# EAGLE design Connector_Board (EAGLE 9.6.1)
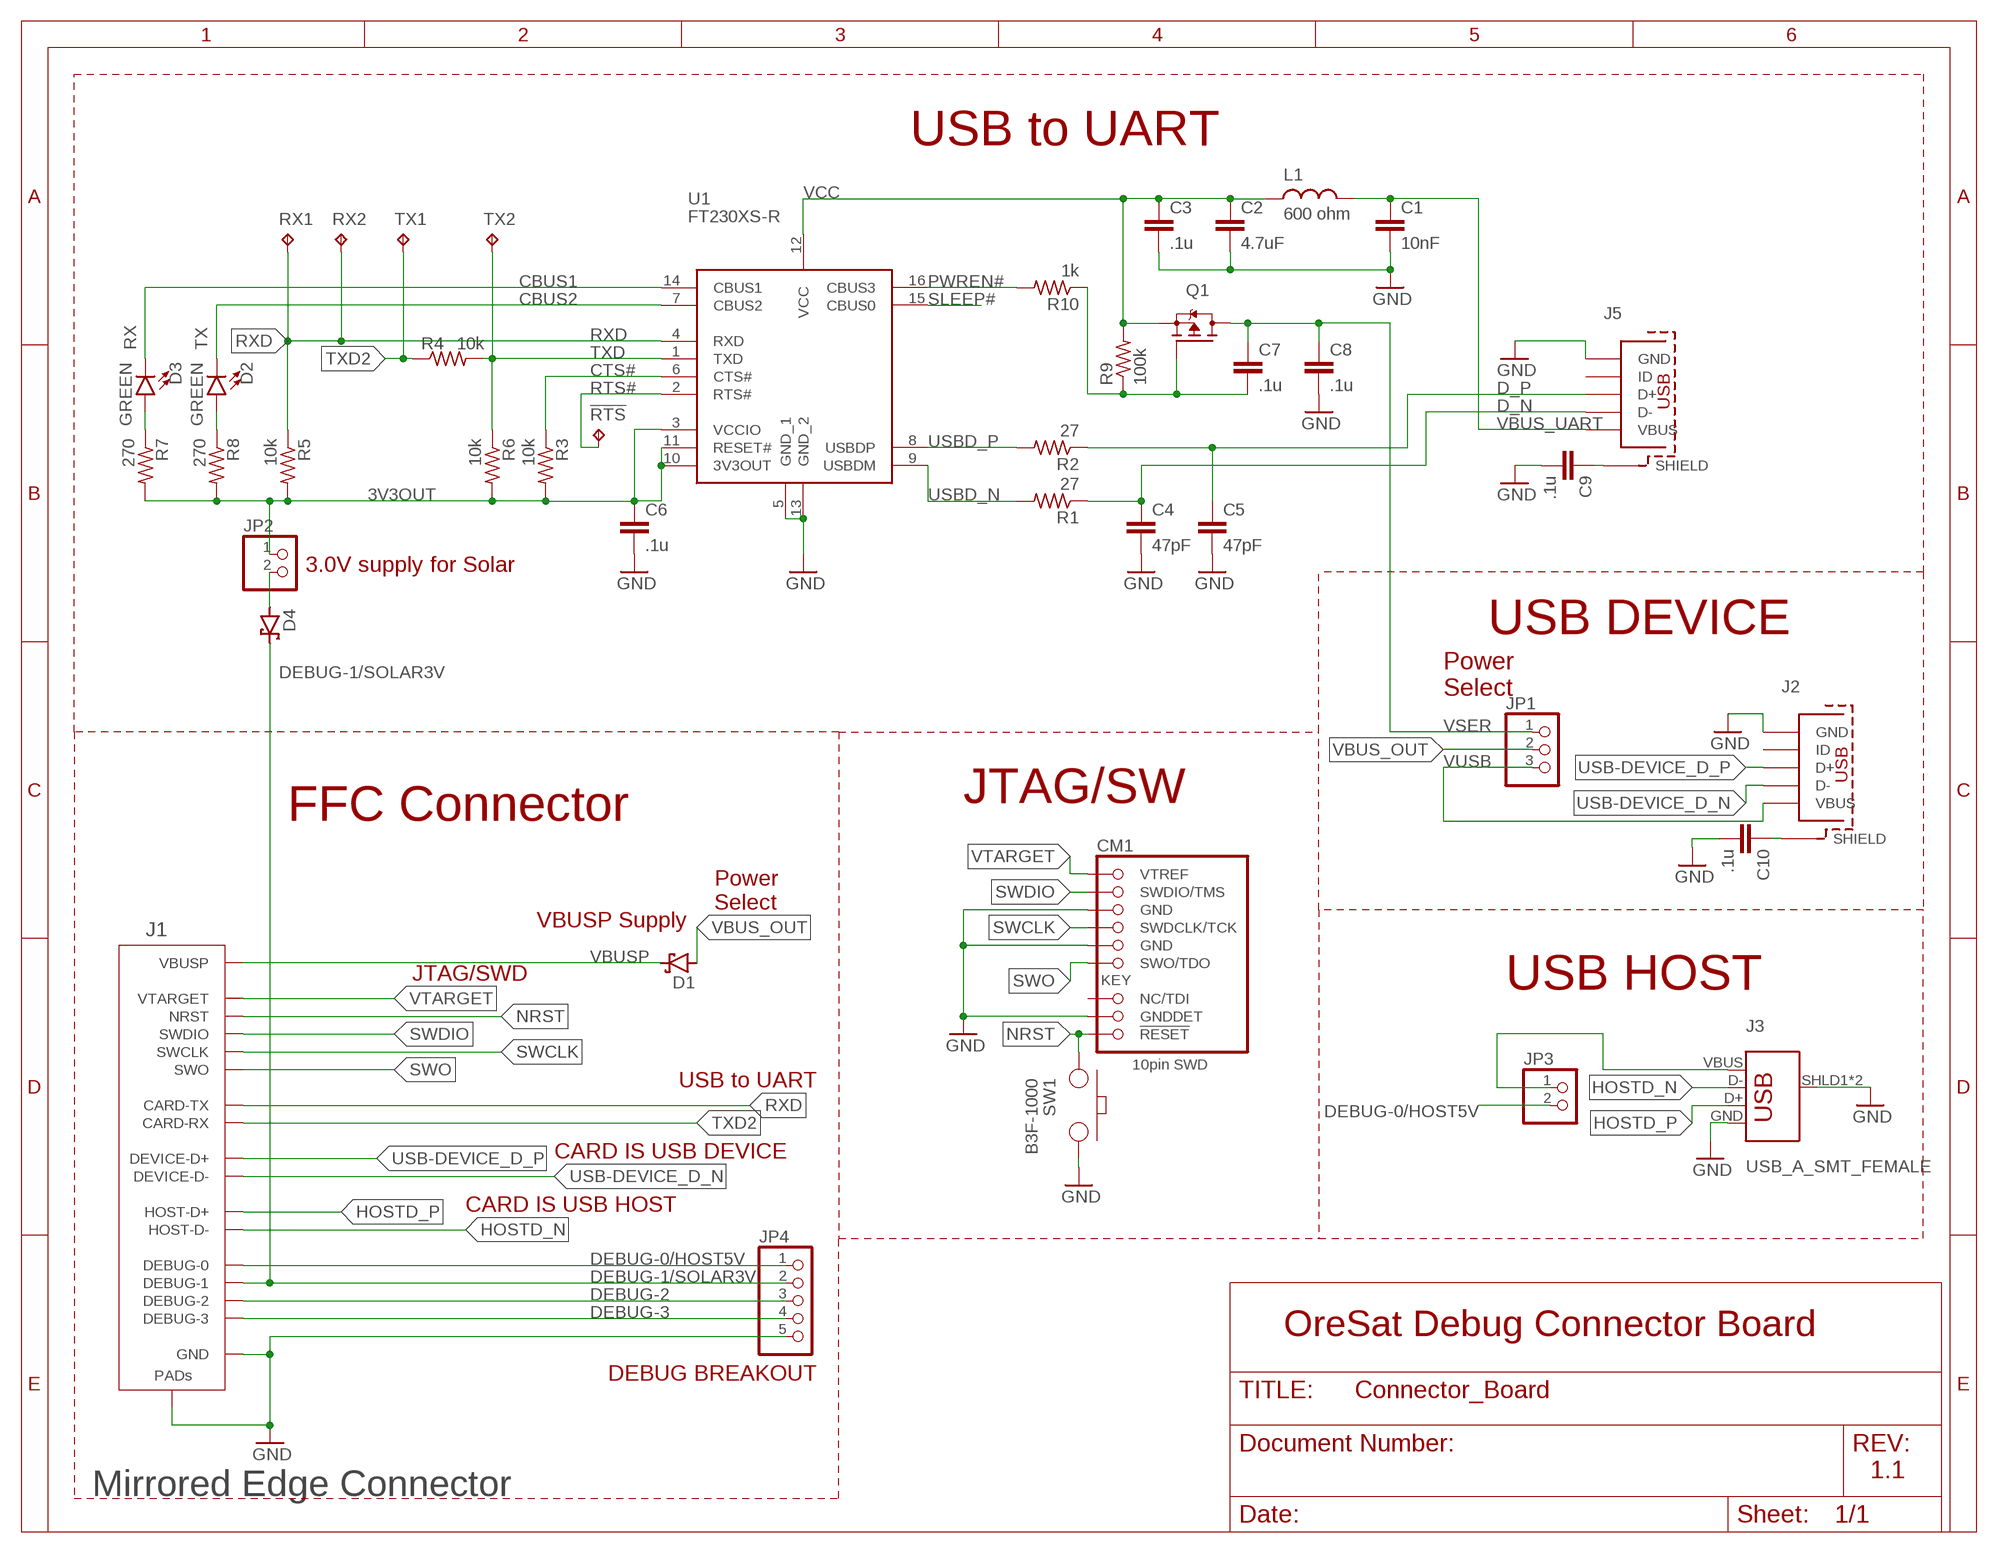
[diagram p0: schematic, sheet 1]

## Parts
!RTS  TEST-POINT-LARGE  [1X01]
C1  10nF  C-EU0603-C-NOSILK  [.0603-C-NOSILK]
C2  4.7uF  C-EU0603-C-NOSILK  [.0603-C-NOSILK]
C3  .1u  C-EU0603-C-NOSILK  [.0603-C-NOSILK]
C4  47pF  C-EU0603-C-NOSILK  [.0603-C-NOSILK]
C5  47pF  C-EU0603-C-NOSILK  [.0603-C-NOSILK]
C6  .1u  C-EU0603-C-NOSILK  [.0603-C-NOSILK]
C7  .1u  C-EU0603-C-NOSILK  [.0603-C-NOSILK]
C8  .1u  C-EU0603-C-NOSILK  [.0603-C-NOSILK]
C9  .1u  C-EU0603-C-NOSILK  [.0603-C-NOSILK]
C10  .1u  C-EU0603-C-NOSILK  [.0603-C-NOSILK]
CM1  FTSH-105-XX-X-DV-K  [CON10_2X5_DUK_FTSH]
D1  CDBU0520  [DIOC1709X85N]
D2  GREEN  LED-GREEN0603  [LED-0603]
D3  GREEN  LED-GREEN0603  [LED-0603]
D4  CDBU0520  [DIOC1709X85N]
J1  ORESAT-DEBUG-CONNECTOR-MIRRORED-ALL  [TE_2-1734592-0]
J2  MICRO-USB-SOCKET  [629105136821]
J3  USB_A_SMT_FEMALE  [USB-A-S-SILK-FEMALE]
J5  MICRO-USB-SOCKET  [629105136821]
JP1  PINHD-1X3  [1X03]
JP2  PINHD-1X2  [1X02]
JP3  PINHD-1X2  [1X02]
JP4  PINHD-1X5  [1X05]
L1  600 ohm  L-US0805-A-NOSILK  [.0805-A-NOSILK]
Q1  MOSFET-PCH-SOT23-6  [SOT23-6]
R1  27  R-US_0603-C-NOSILK  [.0603-C-NOSILK]
R2  27  R-US_0603-C-NOSILK  [.0603-C-NOSILK]
R3  10k  R-US_0603-C-NOSILK  [.0603-C-NOSILK]
R4  10k  R-US_0603-C-NOSILK  [.0603-C-NOSILK]
R5  10k  R-US_0603-C-NOSILK  [.0603-C-NOSILK]
R6  10k  R-US_0603-C-NOSILK  [.0603-C-NOSILK]
R7  270  R-US_0603-C-NOSILK  [.0603-C-NOSILK]
R8  270  R-US_0603-C-NOSILK  [.0603-C-NOSILK]
R9  100k  R-US_0603-C-NOSILK  [.0603-C-NOSILK]
R10  1k  R-US_0603-C-NOSILK  [.0603-C-NOSILK]
RX1  TEST-POINT-LARGE  [1X01]
RX2  TEST-POINT-LARGE  [1X01]
SW1  B3F-1000  SW-MOM-TACTILE-B3F-1000  [SW-MOM-OMRON-6X6X4.3]
TX1  TEST-POINT-LARGE  [1X01]
TX2  TEST-POINT-LARGE  [1X01]
U1  FT230XS-R  [SOP64P599X175-16N]

## Nets
3V3OUT: C6.1 JP2.1 R3.2 R5.2 R6.2 R7.2 R8.2 U1.3(VCCIO) U1.10(3V3OUT) U1.11(RESET#)
CBUS1: D3.C U1.14(CBUS1)
CBUS2: D2.C U1.7(CBUS2)
CTS#: R3.1 U1.6(CTS#)
D_N [diff pairs]: C4.1 J5.2(D-) R1.1
D_P [diff pairs]: C5.1 J5.3(D+) R2.1
DEBUG-0/HOST5V: J1.4(DEBUG-0) JP3.2 JP4.1
DEBUG-1/SOLAR3V: D4.1(C) J1.3(DEBUG-1) JP4.2
DEBUG-2: J1.2(DEBUG-2) JP4.3
DEBUG-3: J1.1(DEBUG-3) JP4.4
GND: C1.2 C2.2 C3.2 C4.2 C5.2 C6.2 C8.2 C9.2 C10.2 CM1.3(GND) CM1.5(GND) CM1.9(GNDDET) J1.12(GND) J1.15(GND) J1.18(GND) J1.PAD1(PAD) J1.PAD2(PAD) J2.5(GND) J3.GND J3.SHLD1(SHIELD) J3.SHLD2(SHIELD) J5.5(GND) JP4.5 SW1.3 SW1.4 U1.5(GND_1) U1.13(GND_2)
HOSTD_N [diff pairs]: J1.13(HOST-D-) J3.D-
HOSTD_P [diff pairs]: J1.14(HOST-D+) J3.D+
N$1: C9.1 J5.SHELL1(SHIELD) J5.SHELL2(SHIELD) J5.SHELL3(SHIELD) J5.SHELL(SHIELD)
N$2: J3.VBUS JP3.1
N$3: C7.2 Q1.3(G) R9.1 R10.1
N$4: D2.A R8.1
N$5: D3.A R7.1
N$6: C10.1 J2.SHELL1(SHIELD) J2.SHELL2(SHIELD) J2.SHELL3(SHIELD) J2.SHELL(SHIELD)
N$7: D4.2(A) JP2.2
NRST: CM1.10(!RESET) J1.11(NRST) SW1.1 SW1.2
PWREN#: R10.2 U1.16(CBUS3)
RTS#: !RTS.1(TP) U1.2(RTS#)
RXD: J1.8(CARD-TX) R5.1 RX1.1(TP) RX2.1(TP) U1.4(RXD)
SLEEP#: U1.15(CBUS0)
SWCLK: CM1.4(SWDCLK/TCK) J1.6(SWCLK)
SWDIO: CM1.2(SWDIO/TMS) J1.7(SWDIO)
SWO: CM1.6(SWO/TDO) J1.5(SWO)
TXD: R4.2 R6.1 TX2.1(TP) U1.1(TXD)
TXD2: J1.9(CARD-RX) R4.1 TX1.1(TP)
USB-DEVICE_D_N [diff pairs]: J1.16(DEVICE-D-) J2.2(D-)
USB-DEVICE_D_P [diff pairs]: J1.17(DEVICE-D+) J2.3(D+)
USBD_N [diff pairs]: R1.2 U1.9(USBDM)
USBD_P [diff pairs]: R2.2 U1.8(USBDP)
VBUS_OUT: D1.2(A) JP1.2
VBUS_UART: C1.1 J5.1(VBUS) L1.2
VBUSP: D1.1(C) J1.19(VBUSP) J1.20(VBUSP)
VCC: C2.1 C3.1 L1.1 Q1.4(S) R9.2 U1.12(VCC)
VSER: C7.1 C8.1 JP1.1 Q1.1(D) Q1.2(D) Q1.5(D) Q1.6(D)
VTARGET: CM1.1(VTREF) J1.10(VTARGET)
VUSB: J2.1(VBUS) JP1.3
Unconnected: CM1.8(NC/TDI) J2.4(ID) J5.4(ID)

## Notes on the sheet
- USB to UART
- RX | TX
- 3.0V supply for Solar
- USB DEVICE
- Power
  Select
- JTAG/SW
- FFC Connector
- Power
  Select
- VBUSP Supply
- JTAG/SWD
- USB HOST
- USB to UART
- CARD IS USB DEVICE
- CARD IS USB HOST
- OreSat Debug Connector Board
- DEBUG BREAKOUT
- 1.1
- Mirrored Edge Connector

## Library data of the parts
!RTS RX1 RX2 TX1 TX2 = oresat-misc:TEST-POINT-LARGE
C1 = oresat-rcl:C-EU: CAPACITOR, European symbol; DESCRIPTION: 10000pF ±10% 50V Ceramic Capacitor X7R 0603 (1608 Metric); DIGI-KEY_PART_NUMBER: 732-13185-1-ND; MANUFACTURER: Wurth Elektronik; MANUFACTURER_PART_NUMBER: 885382206002; VDC: 50V
C2 = oresat-rcl:C-EU: CAPACITOR, European symbol; DESCRIPTION: 4.7µF ±10% 10V Ceramic Capacitor X7S 0603 (1608 Metric); DIGI-KEY_PART_NUMBER: 445-14258-1-ND; MANUFACTURER: TDK; MANUFACTURER_PART_NUMBER: C1608X7S1A475K080AC; VDC: 10V
C3 C6-C10 = oresat-rcl:C-EU: CAPACITOR, European symbol; DESCRIPTION: 0.1µF ±10% 10V Ceramic Capacitor X5R 0603 (1608 Metric); DIGI-KEY_PART_NUMBER: 478-0603ZD104KAT2ACT-ND; MANUFACTURER: AVX; MANUFACTURER_PART_NUMBER: 0603ZD104KAT2A; VDC: 10V
C4 C5 = oresat-rcl:C-EU: CAPACITOR, European symbol; DESCRIPTION: CAP CER 47PF 25V NP0 0603; DIGI-KEY_PART_NUMBER: 478-12679-1-ND; MANUFACTURER: AVX Corporation; MANUFACTURER_PART_NUMBER: 06033A470FAT2A; VDC: 25V
CM1 = J-Samtec-FTSH-105-XXX-DV-K-ARM-SWD:FTSH-105-XX-X-DV-K; DESCRIPTION: Connector Header Surface Mount 10 position 0.050" (1.27mm); DIGI-KEY_PART_NUMBER: SAM13160CT-ND; MANUFACTURER: Samtec Inc.; MANUFACTURER_PART_NUMBER: FTSH-105-01-F-DV-K-TR
D1 D4 = D-Comchip_Schottky_Diode_CDBU0520:CDBU0520: COMCHIP TECHNOLOGY CDBU0520, SMT Schottky Diode, 30V 0.5A, 2-Pin SOD-523F (0603) Source: Datasheet <http://www.comchiptech.com/admin/files/product/CDBU0520-HF-RevA797161.pdf>; DESCRIPTION: Diode Schottky 20V 500mA Surface Mount 0603/SOD-523F; DIGI-KEY_PART_NUMBER: 641-1332-1-ND; MANUFACTURER: Comchip Technology; MANUFACTURER_PART_NUMBER: CDBU0520
D2 D3 = SparkFun-LED:LED-GREEN: Green SMD LED Used in manufacturing of various products at SparkFun Packages: 0603 - SMD 0603 package [Product Link] <http://www.futureelectronics.com/en/technologies/semiconductors/optoelectronics/leds/Pages/9894312-LTST-C190GKT.aspx?CrossPart=HSMG-C190&IM=0> LilyPad 1206 - SMD1206 LilyPad package [Product Link] <http://www.futureelectronics.com/en/Technologies/Product.aspx?ProductID=IN150NGHARVATEKCORPORATION2049943&IM=0> 1206 - SMD1206 package [Product Link] <http://www.futureelectronics.com/en/technologies/semiconductors/optoelectronics/leds/Pages/8315665-LTST-C150KGKT.aspx?IM=0> 1206 Bottom Mount -SMD 1206 Bottom Mount [Product Link] <http://www.digikey.com/product-detail/en/lite-on-inc/LTST-C230KGKT/160-1456-1-ND/386854> SparkFun Products: Pro Mini 328 -5V <https://www.sparkfun.com/products/821> RedBoard <https://www.sparkfun.com/products/12757> MP3 Trigger <https://www.sparkfun.com/products/13720> Makey Makey <https://www.sparkfun.com/products/11076>; DESCRIPTION: Green 573nm LED Indication - Discrete 2V 0603 (1608 Metric); DIGI-KEY_PART_NUMBER: 732-12017-1-ND; MANUFACTURER: Würth Elektronik; MANUFACTURER_PART_NUMBER: 150060VS55040; PROD_ID: DIO-00821
J1 = oresat-debug-connector:ORESAT-DEBUG-CONNECTOR-MIRRORED; DESCRIPTION: 20 Position FPC Connector Contacts, Bottom 0.020" (0.50mm) Surface Mount, Right Angle; DIGI-KEY_PART_NUMBER: A100287CT-ND; MANUFACTURER: TE Connectivity AMP Connectors; MANUFACTURER_PART_NUMBER: 2-1734592-0
J2 J5 = J-Wurth-629105136821-Micro-USB-A:MICRO-USB-SOCKET: WR-COM SMT Horizontal 5 Contacts Micro USB Type B,5 pins=>Code : Con_I-O_COM_MicroUSB_629105136821 <http://katalog.we-online.de/media/images/eican/Con_I-O_COM_MicroUSB_629105136821_pf2.jpg> Details see: http://katalog.we-online.de/en/em/COM_MICRO_SMT_TYPE_B_HORIZONTAL/629105136821?m Created 2014-07-09, Karrer Zheng 2014 (C) Würth Elektronik; DESCRIPTION: CONN RCPT USB2.0 MICRO B SMD R/A; DIGI-KEY_PART_NUMBER: 732-3155-1-ND; MANUFACTURER: Würth Elektronik; MANUFACTURER_PART_NUMBER: 629105136821
J3 = SparkFun-Connectors:USB_A: USB-A Connector Male and female variants, as well as PTH and SMT variants SparkFun Products: SparkFun XBee Explorer Dongle <https://www.sparkfun.com/products/11697> PTH Male SparkFun MicroView-USB Programmer <https://www.sparkfun.com/products/12924> SMT Male SparkFun USB Type A Female Breakout <https://www.sparkfun.com/products/12700> SMT Female; DESCRIPTION: SparkFun Accessories USB Female Type A SMD Connector; MANUFACTURER: SparkFun; MANUFACTURER_PART_NUMBER: PRT-09011; MOUSER_PART_NUMBER: 474-PRT-09011; PROD_ID: CONN-09520; SF_ID: PRT-09011
JP1 = pinhead:PINHD-1X3: PIN HEADER; DESCRIPTION: CONN HEADER VERT 3POS 2.54MM; DIGI-KEY_PART_NUMBER: 732-5316-ND; MANUFACTURER: Würth Elektronik; MANUFACTURER_PART_NUMBER: 61300311121
JP2 JP3 = pinhead:PINHD-1X2: PIN HEADER; DESCRIPTION: Connector Header Through Hole 2 position 0.100" (2.54mm); DIGI-KEY_PART_NUMBER: 732-5315-ND; MANUFACTURER: Würth Elektronik; MANUFACTURER_PART_NUMBER: 61300211121
JP4 = pinhead:PINHD-1X5: PIN HEADER; DESCRIPTION: Connector Header Through Hole 5 position 0.100" (2.54mm); DIGI-KEY_PART_NUMBER: 732-5318-ND; MANUFACTURER: Würth Elektronik; MANUFACTURER_PART_NUMBER: 61300511121
L1 = oresat-rcl:L-US: INDUCTOR, American symbol; DESCRIPTION: FERRITE BEAD 600 OHM 0805 1LN; DIGI-KEY_PART_NUMBER: 240-2390-1-ND; MANUFACTURER: Laird-Signal Integrity Products; MANUFACTURER_PART_NUMBER: MI0805K601R-10
Q1 = Q-MOSFET-PCH-SOT23-6:MOSFET-PCH-SOT23-6: P channel MOSFET in an SOT23-6; DESCRIPTION: P-Channel 30V 4.1A 350mW Surface Mount SOT-23-6L; DIGI-KEY_PART_NUMBER: SIL3407-TPMSCT-ND; MANUFACTURER: Micro Commercial Co; MANUFACTURER_PART_NUMBER: SIL3407-TP
R1 R2 = oresat-rcl:R-US_: RESISTOR, American symbol; DESCRIPTION: RES SMD 27 OHM 1% 1/10W 0603; DIGI-KEY_PART_NUMBER: CR0603-FX-27R0ELFCT-ND; MANUFACTURER: Bourns Inc.; MANUFACTURER_PART_NUMBER: CR0603-FX-27R0ELF
R3-R6 = oresat-rcl:R-US_: RESISTOR, American symbol; DESCRIPTION: 10 kOhms ±1% 0.1W, 1/10W Chip Resistor 0603 (1608 Metric) Moisture Resistant Thick Film; DIGI-KEY_PART_NUMBER: CR0603-FX-1002ELFCT-ND; MANUFACTURER: Bourns; MANUFACTURER_PART_NUMBER: CR0603-FX-1002ELF
R7 R8 = oresat-rcl:R-US_: RESISTOR, American symbol; DESCRIPTION: RES SMD 270 OHM 1% 1/10W 0603; DIGI-KEY_PART_NUMBER: P270HCT-ND; MANUFACTURER: Panasonic Electronic Components; MANUFACTURER_PART_NUMBER: Panasonic Electronic Components
R9 = oresat-rcl:R-US_: RESISTOR, American symbol; DESCRIPTION: 100 kOhms ±5% 0.1W, 1/10W Chip Resistor 0603 (1608 Metric) Automotive AEC-Q200 Thick Film; DIGI-KEY_PART_NUMBER: RMCF0603JG100KTR-ND; MANUFACTURER: Stackpole Electronics Inc; MANUFACTURER_PART_NUMBER: RMCF0603JG100K
R10 = oresat-rcl:R-US_: RESISTOR, American symbol; DESCRIPTION: RES SMD 1K OHM 1% 1/10W 0603; DIGI-KEY_PART_NUMBER: 311-1.00KHRCT-ND; MANUFACTURER: Yageo; MANUFACTURER_PART_NUMBER: RC0603FR-071KL
SW1 = apdm_ap_v2:SW-MOM-TACTILE: Momentary Tactile Switch Mfg.: Omron, Dim: 6mm x 6mm x 4.3mm, 100gf, 10E6 cycles, General Purpose, Mfg. Part No.: B3F-1000, Digikey Part No.: SW400-ND Mfg.: Omron, Dim: 6mm x 6mm x 4.3mm, 150gf, 10E6 cycles, Gold Plated Contacts, Mfg. Part No.: B3F-1002, Digikey Part No.: SW401-ND; DESCRIPTION: SWITCH TACTILE SPST-NO 0.05A 24V; DIGI-KEY_PART_NUMBER: SW400-ND; MANUFACTURER: Omron Electronics Inc-EMC Div; MANUFACTURER_PART_NUMBER: B3F-1000
U1 = U-FTDI-FT230X-USB_to_UART:FT230XS-R: UART Interface RS232, RS422, RS485, SIE, UART 3MBd, 5 V Source: Datasheet <http://www.ftdichip.com/Support/Documents/DataSheets/ICs/DS_FT230X.pdf>; DESCRIPTION: UART Interface RS232, RS422, RS485, SIE, UART 3MBd, 5 V; DIGI-KEY_PART_NUMBER: 768-1135-1-ND; MANUFACTURER: FTDI Chip; MANUFACTURER_PART_NUMBER: FT230XS-R; MOUSER_PART_NUMBER: 895-FT230XS-R

## Net classes
1 diff pairs: width 0.305 mm, clearance 0.152 mm

## Board
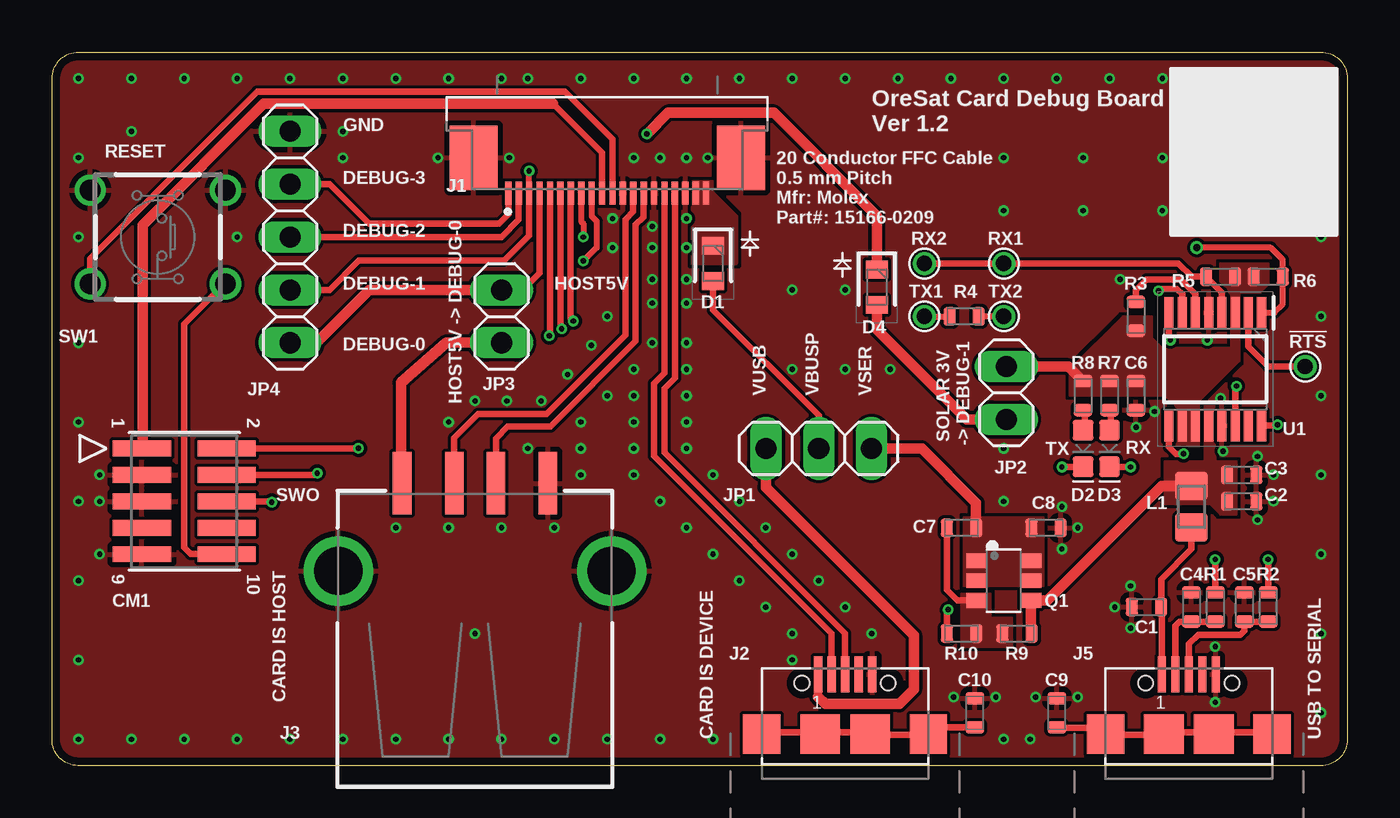
[diagram p1: board, top side]
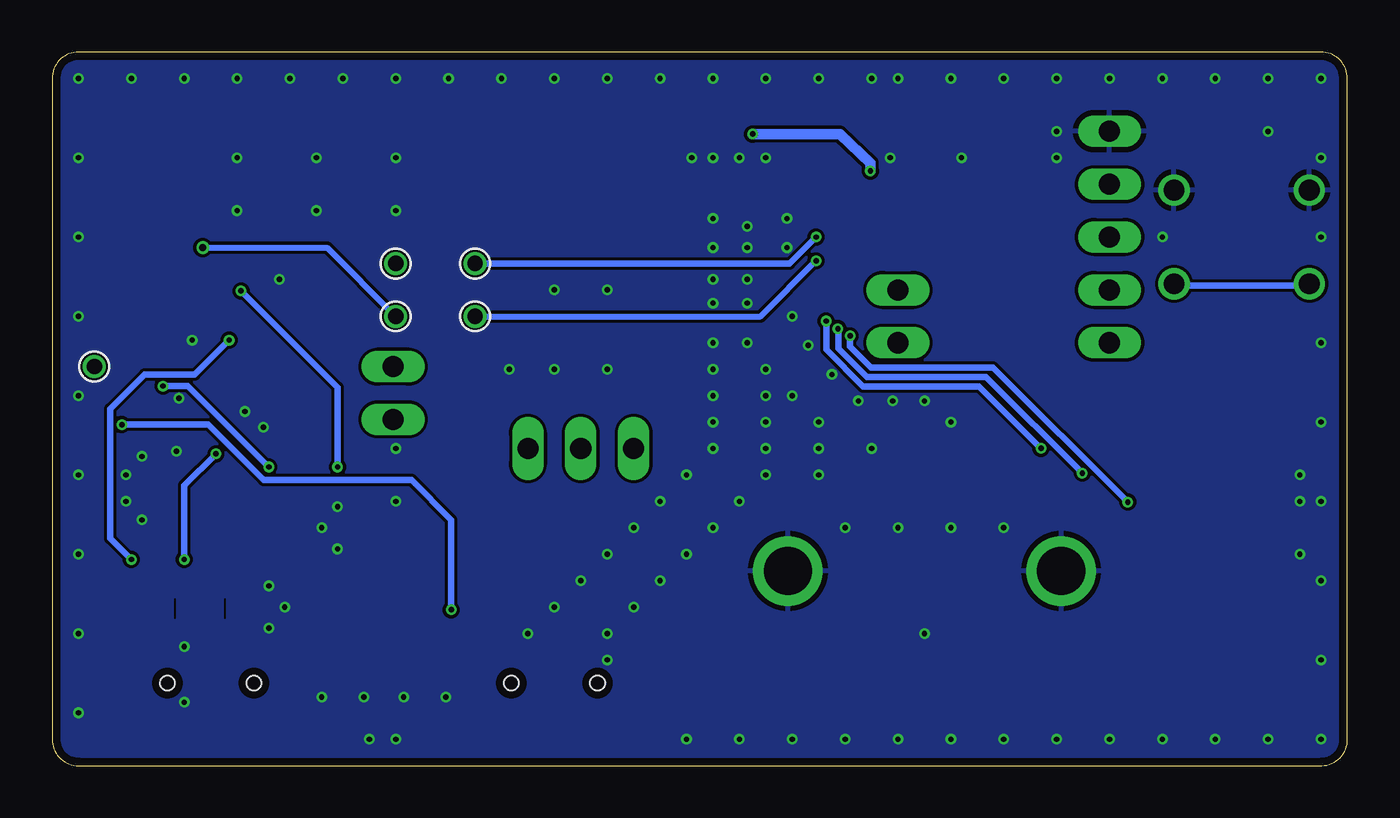
[diagram p2: board, bottom side, seen from below]

Size 62.23 x 34.29 mm. Coordinates in mm from the lower left corner, seen from the top.
Outline: 62.23,33.02 62.23,1.27 arc-90 60.96,0 1.23,0 arc-90 0,1.27 0,33.02 arc-90 1.27,34.29 60.96,34.29 arc-90 62.23,33.02
Copper layers (1*16): Top 0.035559375mm / dielectric 1.6mm / Bottom 0.035559375mm
Design rules "oshpark-2layer *": minimum track width 6mil, minimum drill 10mil, track to track 6mil, track to pad 6mil, pad to pad 6mil, via to via 6mil, smd to smd 6mil, copper to edge 15mil, drill to drill 6mil, minimum pad ring 5mil, minimum via ring 5mil, stop-mask expansion 2.5mil, vias tented up to drill 10mil, thermal gap 10mil
bRestrict: 2 lines

### Footprints (pad centres in the part's own frame; a part is rotated, then mirrored left to right if it is on the bottom)
1X01 = drill 0.737 pad 1.1: 1 0,0
.0603-C-NOSILK = smd 0.6 x 0.9: 1 -0.7,0; 2 0.7,0
CON10_2X5_DUK_FTSH = smd 0.762 x 2.794: 1 -2.54,-2.032; 2 -2.54,2.032; 3 -1.27,-2.032; 4 -1.27,2.032; 5 0,-2.032; 6 0,2.032; 7 1.27,-2.032; 8 1.27,2.032; 9 2.54,-2.032; 10 2.54,2.032
DIOC1709X85N = smd 0.85 x 1.05: 1 -0.85,0; 2 0.85,0
LED-0603 = smd 1 x 1: A -0.877,0; C 0.877,0
TE_2-1734592-0 = smd 0.3 x 1.1: 1 -4.75,-1.7; 2 -4.25,-1.7; 3 -3.75,-1.7; 4 -3.25,-1.7; 5 -2.75,-1.7; 6 -2.25,-1.7; 7 -1.75,-1.7; 8 -1.25,-1.7; 9 -0.75,-1.7; 10 -0.25,-1.7; 11 0.25,-1.7; 12 0.75,-1.7; 13 1.25,-1.7; 14 1.75,-1.7; 15 2.25,-1.7; 16 2.75,-1.7; 17 3.25,-1.7; 18 3.75,-1.7; 19 4.25,-1.7; 20 4.75,-1.7 | smd 2.3 x 3.1: PAD1 6.42,0; PAD2 -6.42,0
629105136821 = smd 0.4 x 1.731: 1 -1.3,2.865; 2 -0.65,2.865; 3 0,2.865; 4 0.65,2.865; 5 1.3,2.865 | smd 1.8 x 1.9: SHELL -4,0; SHELL3 4,0 | smd 1.9 x 1.9: SHELL1 -1.2,0; SHELL2 1.2,0 | hole 0.7: -2.075,2.45; 2.075,2.45
USB-A-S-SILK-FEMALE = smd 3 x 0.9: D+ 7.212,-1; D- 7.212,1; GND 7.212,-3.5; VBUS 7.212,3.5 | drill 2.311: SHLD1 3,-6.566; SHLD2 3,6.566
1X03 = drill 1.016 long: 1 -2.54,0; 2 0,0; 3 2.54,0
1X02 = drill 1.016 long: 1 -1.27,0; 2 1.27,0
1X05 = drill 1.016 long: 1 -5.08,0; 2 -2.54,0; 3 0,0; 4 2.54,0; 5 5.08,0
.0805-A-NOSILK = smd 1.35 x 1.55: 1 -1,0; 2 1,0
SOT23-6 = smd 0.7 x 1: 1 -0.95,-1.3; 2 0,-1.3; 3 0.95,-1.3; 4 0.95,1.3; 5 0,1.3; 6 -0.95,1.3
SW-MOM-OMRON-6X6X4.3 = drill 1: 1 3.25,-2.25; 2 -3.25,-2.25; 3 3.25,2.25; 4 -3.25,2.25
SOP64P599X175-16N = smd 1.526 x 0.435: 1 -2.712,2.222; 2 -2.712,1.588; 3 -2.712,0.952; 4 -2.712,0.318; 5 -2.712,-0.318; 6 -2.712,-0.952; 7 -2.712,-1.588; 8 -2.712,-2.222; 9 2.712,-2.222; 10 2.712,-1.588; 11 2.712,-0.952; 12 2.712,-0.318; 13 2.712,0.318; 14 2.712,0.952; 15 2.712,1.588; 16 2.712,2.222

### Placement (x,y rotation side)
!RTS  60.2,19.18 0 top
C1  52.58,7.62 180 top
C2  57.15,12.7 0 top
C3  57.15,13.97 0 top
C4  54.74,7.62 90 top
C5  57.28,7.62 90 top
C6  52.07,17.78 270 top
C7  43.69,11.43 180 top
C8  47.75,11.43 0 top
C9  48.26,2.54 90 top
C10  44.32,2.54 90 top
CM1  6.35,12.7 270 top
D1  31.75,24.13 270 top
D2  49.53,15.24 270 top
D3  50.8,15.24 270 top
D4  39.62,22.99 270 top
J1  26.67,29.21 0 top
J2  38.1,1.52 0 top
J3  20.32,6.35 90 top
J5  54.61,1.52 0 top
JP1  36.83,15.24 180 top
JP2  45.85,17.91 270 top
JP3  21.59,21.59 90 top
JP4  11.43,25.4 90 top
L1  54.74,12.45 270 top
Q1  45.72,8.89 270 top
R1  55.88,7.62 90 top
R2  58.42,7.62 90 top
R3  52.07,21.59 270 top
R4  43.81,21.59 0 top
R5  56.13,23.5 0 top
R6  58.42,23.5 180 top
R7  50.8,17.78 90 top
R8  49.53,17.78 90 top
R9  46.35,6.35 0 top
R10  43.69,6.35 180 top
RX1  45.72,24.13 0 top
RX2  41.91,24.13 0 top
SW1  5.08,25.4 0 top
TX1  41.91,21.59 0 top
TX2  45.72,21.59 0 top
U1  55.88,19.05 270 top

### Tracks (layer width: path | path; a pad name or v marks a point on that pad's centre or on a via)
3V3OUT
  Top 0.5: R8.2 48.83,19.18 JP2.1
  pour Top (rank 2, no thermals): 58.04,22.73 57.02,22.73 57.02,19.43 55.08,17.49 55.08,15.37 53.98,15.37 53.98,17.27 53.47,17.78 48.9,17.78 48.9,19.05 51.44,21.59 52.83,21.59 52.83,20.57 53.34,20.07 56.64,20.07 56.64,22.61 56.13,23.11 56.13,24.13 58.42,24.13 58.42,23.11
CBUS1  (via drill 0.25)
  Top 0.305: v51.82,14.35 51.8,14.36 D3.C | v56.9,18.24 56.83,18.17 U1.14
  Bottom 0.305: v51.82,14.35 55.7,18.24 v56.9,18.24
CBUS2  (via drill 0.25)
  Top 0.305: D2.C 49.52,14.35 v48.51,14.35 | v53.15,22.81 53.16,22.81 53.26,22.91 54.04,22.91 54.29,22.66 U1.7
  Bottom 0.305: v48.51,14.35 48.51,18.17 v53.15,22.81
CTS#
  Top 0.305: U1.6 54.93,22.67 54.23,23.37 52.58,23.37 52.07,22.86 R3.1
D_N
  Top 0.305: J5.2 53.96,6.72 54.16,6.92 C4.1 R1.1
D_P
  Top 0.305: J5.3 54.61,5.84 55.05,6.29 57.09,6.29 57.28,6.48 C5.1 R2.1
DEBUG-0/HOST5V
  Top 0.305: J1.4 23.42,23.67 22.61,22.86
  Top 0.406: 22.61,22.86 JP3.2
  Top 0.508: JP3.2 15.24,22.86 12.7,20.32 JP4.1
DEBUG-1/SOLAR3V  (via drill 0.25)
  Top 0.3: J1.3 v22.92,28.57
  Top 0.305: J1.3 22.92,25.46 21.72,24.26 14.73,24.26 13.34,22.86 JP4.2
  Top 0.5: v28.57,30.35 29.59,31.37 34.67,31.37 39.62,26.42 D4.1
  Bottom 0.5: v28.57,30.35 24.38,30.35 22.92,28.96 v22.92,28.57
DEBUG-2
  Top 0.305: J1.2 22.42,26.23 21.59,25.4 JP4.3
DEBUG-3
  Top 0.305: J1.1 21.92,26.49 21.46,26.04 15.24,26.04 13.34,27.94 JP4.4
GND  (via drill 0.25)
  other vias: 56.13,17.65 56.26,15.11 57.91,14.86 57.91,11.81 58.67,12.7 58.67,13.97 55.5,20.45 52.07,16.26 52.96,17.02 48.51,12.45 49.28,11.43 48.51,10.41 51.05,7.62 51.82,8.64 51.82,6.6 49.28,3.3 47.24,3.3 45.34,3.3 43.31,3.3 24.13,11.43 25.4,15.24 2.29,10.16 2.29,12.7 2.29,13.97 27.94,29.21 29.21,29.21 30.48,29.21 21.97,29.21 31.5,29.21 26.92,26.29 30.48,26.29 55.88,5.71 55.88,3.05 38.1,7.62 34.29,7.62 33.02,8.89 31.75,10.16 30.48,11.43 29.21,12.7 27.94,13.97 27.94,15.24 27.94,16.51 27.94,17.78 27.94,19.05 28.83,20.32 30.48,20.32 30.48,19.05 30.48,17.78 30.48,16.51 30.48,15.24 31.75,13.97 33.02,12.7 34.29,11.43 35.56,10.16 36.83,8.89 35.56,6.35 39.37,6.35 35.56,5.08 19.05,16.51 25.91,20.19 23.5,17.53 24.77,18.8 30.48,22.23 30.48,23.37 30.48,24.89 28.83,22.23 28.83,23.37 28.83,24.89 28.83,25.91 22.86,15.24 20.32,17.53 21.84,17.53 26.67,21.59 25.4,13.97 26.92,24.89 1.27,33.02 1.27,25.4 1.27,20.32 1.27,12.7 1.27,5.08 1.27,1.27 1.27,8.89 1.27,16.51 1.27,29.21 3.81,33.02 6.35,33.02 8.89,33.02 11.43,33.02 13.97,33.02 16.51,33.02 19.05,33.02 21.59,33.02 60.96,33.02 60.96,29.21 60.96,25.4 60.96,21.59 60.96,17.78 60.96,13.97 60.96,10.16 60.96,6.35 60.96,2.54 46.99,1.27 45.72,1.27 31.75,1.27 29.21,1.27 26.67,1.27 24.13,1.27 21.59,1.27 19.05,1.27 16.51,1.27 13.97,1.27 11.43,1.27 8.89,1.27 6.35,1.27 3.81,1.27 58.42,33.02 55.88,33.02 53.34,33.02 50.8,33.02 48.26,33.02 45.72,33.02 43.18,33.02 40.64,33.02 38.1,33.02 35.56,33.02 33.02,33.02 30.48,33.02 27.94,33.02 25.4,33.02 22.86,33.02 20.32,6.35 45.72,12.7 45.72,15.24 51.31,23.37 40.26,19.05 38.1,19.05 35.56,19.05 35.56,22.86 38.1,22.86 45.72,26.67 45.72,29.21 49.53,26.67 49.53,29.21 53.34,26.67 53.34,29.21 13.97,30.48 8.89,25.4 18.54,29.21 13.97,29.21 3.81,30.48 25.4,16.51 26.67,17.78 21.59,11.43 19.05,11.43 16.51,11.43
  pour Bottom (rank 6): 62.23,34.29 0,34.29 0,0 62.23,0
  pour Top (rank 6): 62.23,34.29 0,34.29 0,0 62.23,0
HOSTD_N
  Top 0.305: J1.13 27.92,26.62 27.54,26.24 27.54,20.68 23.75,16.89 20.46,16.89 19.32,15.76 J3.D-
HOSTD_P
  Top 0.305: J1.14 28.42,26.37 28.04,25.99 28.04,20.41 23.94,16.31 21.89,16.31 21.32,15.73 J3.D+
N$1
  Top 0.305: C9.1 48.35,1.83 50.29,1.83 50.52,1.6 J5.SHELL 50.75,1.49 53.26,1.49 J5.SHELL1 53.49,1.6 55.78,1.6 J5.SHELL2 55.89,1.6 58.52,1.6 J5.SHELL3
N$2
  Top 0.508: J3.VBUS 16.76,13.62 16.76,18.4 18.96,20.32 JP3.1
N$3
  Top 0.305: Q1.3 43.49,7.94 42.99,8.45 C7.2
  pour Top (rank 2, no thermals): 43.69,8.26 45.09,8.26 45.09,7.11 46.1,7.11 46.1,5.71 43.69,5.71
N$4
  Top 0.305: R8.1 49.61,17.03 49.61,16.23 D2.A
N$5
  Top 0.305: R7.1 50.86,17.03 50.86,16.23 D3.A
N$6
  Top 0.305: J2.SHELL 34.18,1.6 36.8,1.6 J2.SHELL1 37.03,1.6 39.2,1.6 J2.SHELL2 39.43,1.49 41.95,1.49 J2.SHELL3 42.42,1.84 C10.1
N$7
  Top 0.5: D4.2 39.62,20.95 43.94,16.64 JP2.2
NRST
  Top 0.305: CM1.10 8.34,10.17 6.67,10.17 6.35,10.49 6.35,21.21 8.23,23.09 SW1.1 | SW1.2 1.83,24.36 9.86,32.38 24.64,32.38 26.92,30.1 J1.11
  Bottom 0.305: SW1.2 1.9,23.08 8.26,23.08 SW1.1
PWREN#  (via drill 0.25)
  Top 0.305: R10.2 42.99,7.43 v43.05,7.49 | v58.88,16.38 58.83,16.34 U1.16
  Bottom 0.305: v43.05,7.49 43.05,11.81 44.96,13.72 52.07,13.72 54.74,16.38 v58.88,16.38
RTS#
  Top 0.305: U1.2 57.47,20.13 58.42,19.18 !RTS.1
RXD  (via drill 0.25)
  Top 0.3: J1.8 25.42,26.14 25.53,26.04 v25.53,25.4
  Top 0.305: U1.4 56.2,22.73 R5.1 54.75,23.5 54.11,24.13 RX1.1 RX2.1
  Bottom 0.305: RX2.1 26.8,24.13 v25.53,25.4
SWCLK  (via drill 0.25)
  Top 0.305: v12.74,14.06 12.65,13.97 CM1.4 | v24.48,20.99 24.42,21.05 J1.6
  Bottom 0.305: v12.74,14.06 17.36,18.68 23.07,18.68 24.45,20.05 24.45,20.96 v24.48,20.99
SWDIO  (via drill 0.25)
  Top 0.305: CM1.2 v14.71,15.24 v14.72,15.25 | v25.05,21.36 24.92,21.49 J1.7
  Bottom 0.305: v14.72,15.25 17.7,18.22 23.26,18.22 25.04,20 v25.04,21.36 v25.05,21.36
SWO  (via drill 0.25)
  Top 0.305: J1.5 23.92,20.68 v23.89,20.65 | v10.55,12.66 10.55,12.69 8.46,12.69 CM1.6
  Bottom 0.305: v10.55,12.66 17.03,19.14 22.89,19.14 23.89,20.14 v23.89,20.65
TXD  (via drill 0.35)
  Top 0.3: U1.1 58.72,21.76 59.12,22.16 R6.1 59.12,24.32 58.55,24.89 v54.99,24.89 | TX2.1 R4.2
  Bottom 0.3: v54.99,24.89 49.02,24.89 TX2.1
TXD2  (via drill 0.25)
  Top 0.3: TX1.1 R4.1 | J1.9 25.92,26.4 26.16,26.16 26.16,24.89 v25.53,24.26
  Bottom 0.3: TX1.1 28.19,21.59 v25.53,24.26
USB-DEVICE_D_N
  Top 0.305: J1.16 29.42,18.87 28.91,18.37 28.91,14.89 37.45,6.35 J2.2
USB-DEVICE_D_P
  Top 0.305: J1.17 29.92,18.62 29.41,18.11 29.41,15.04 38.1,6.35 J2.3
USBD_N  (via drill 0.25)
  Top 0.305: U1.9 53.66,15.3 53.98,14.99 v54.36,14.99 | v55.88,9.91 R1.2
  Bottom 0.305: v54.36,14.99 55.88,13.46 v55.88,9.91
USBD_P  (via drill 0.25)
  Top 0.305: U1.8 53.66,20.51 v53.72,20.45 | v58.42,9.91 R2.2
  Bottom 0.305: v53.72,20.45 55.37,18.8 57.78,18.8 59.44,17.14 59.44,10.92 v58.42,9.91
VBUS_OUT
  Top 0.305: D1.2 31.75,21.89 36.83,16.82 JP1.2
VBUS_UART
  Top 0.305: J5.1 53.31,7.59 C1.1 53.28,8.96 54.74,10.41 L1.2
VBUSP
  pour Top (rank 2, no thermals): 30.73,28.07 30.73,24.13 32.89,24.13 32.89,26.42 31.75,27.56 31.75,28.07
VCC
  Top 0.508: L1.1 53.32,13.45 47.82,7.94 Q1.4 47.02,6.38 R9.2
  pour Top (rank 2, no thermals): 55.88,17.27 55.37,17.27 55.37,14.61 53.47,14.61 53.47,12.57 55.63,12.57 56.13,12.06 56.9,12.06 56.9,14.61 55.88,14.61
VSER
  Top 0.508: JP1.1 41.78,15.24 44.39,12.63 C7.1
  pour Top (rank 2, no thermals): 43.81,8.64 43.81,11.94 47.62,11.94 47.62,8.64
VTARGET
  Top 0.305: 24.08,31.8 26.42,29.46 26.42,28.29 J1.10
  Top 0.508: CM1.1 4.34,15.32 4.34,25.97 10.17,31.8 24.08,31.8
VUSB
  Top 0.406: J2.1 36.79,3.31
  Top 0.508: 36.79,3.31 37.15,2.96 40.7,2.96 41.4,3.66 41.4,6.26 34.29,13.37 JP1.3

### Text on the board
tPlace: GND | OreSat Card Debug Board / Ver 1.2 | RESET | DEBUG-3 | 20 Conductor FFC Cable / 0.5 mm Pitch / Mfr: Molex / Part#: 15166-0209 | DEBUG-2 | DEBUG-1 | HOST5V | DEBUG-0 | VUSB | VBUSP | VSER | SOLAR 3V / -> DEBUG-1 | HOST5V -> DEBUG-0 | TX | RX | SWO | CARD IS HOST | CARD IS DEVICE | USB TO SERIAL